# EAGLE design cap (EAGLE 7.2.0)
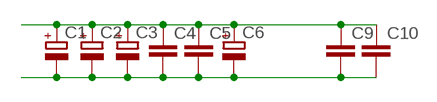
[diagram p0: schematic, sheet 1]

## Parts
C1  CPOL-EUE7.5-18  [E7,5-18]
C2  CPOL-EUE7.5-18  [E7,5-18]
C3  CPOL-EUE7.5-18  [E7,5-18]
C4  C-EU075-052X106  [C075-052X106]
C5  C-EU075-052X106  [C075-052X106]
C6  CPOL-EUE7.5-18  [E7,5-18]
C9  C-EU075-052X106  [C075-052X106]
C10  C-EU075-052X106  [C075-052X106]

## Nets
V+: C1.+ C2.+ C3.+ C4.1 C5.1 C6.+ C9.1 C10.1
V-: C1.- C2.- C3.- C4.2 C5.2 C6.- C9.2 C10.2

## Library data of the parts
C1-C3 C6 = Vwvwbg:CPOL-EU: POLARIZED CAPACITOR, European symbol
C4 C5 C9 C10 = Vwvwbg:C-EU: CAPACITOR, European symbol

## Board
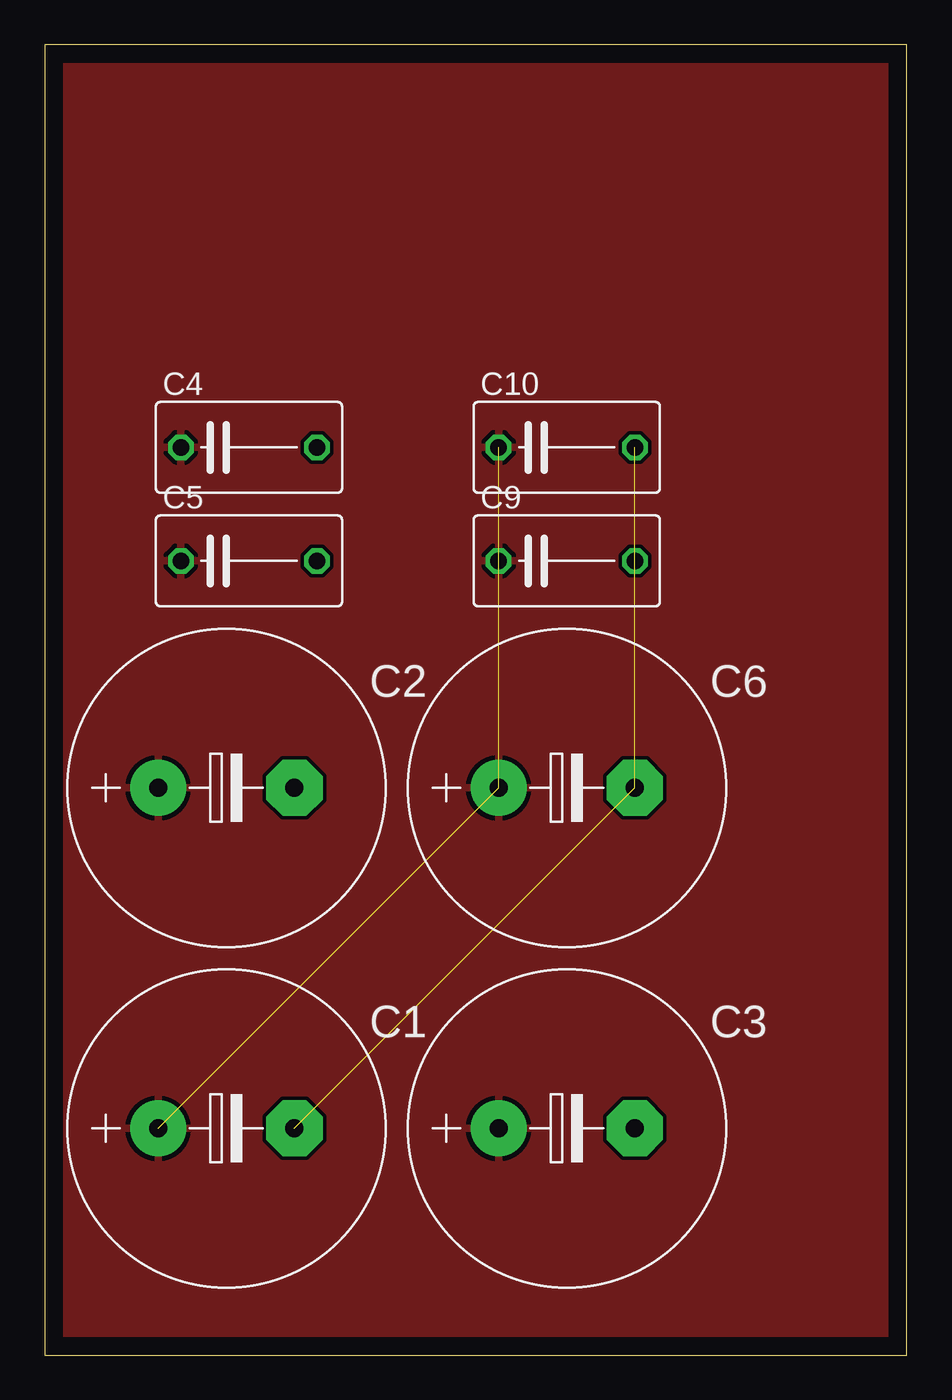
[diagram p1: board, top side]
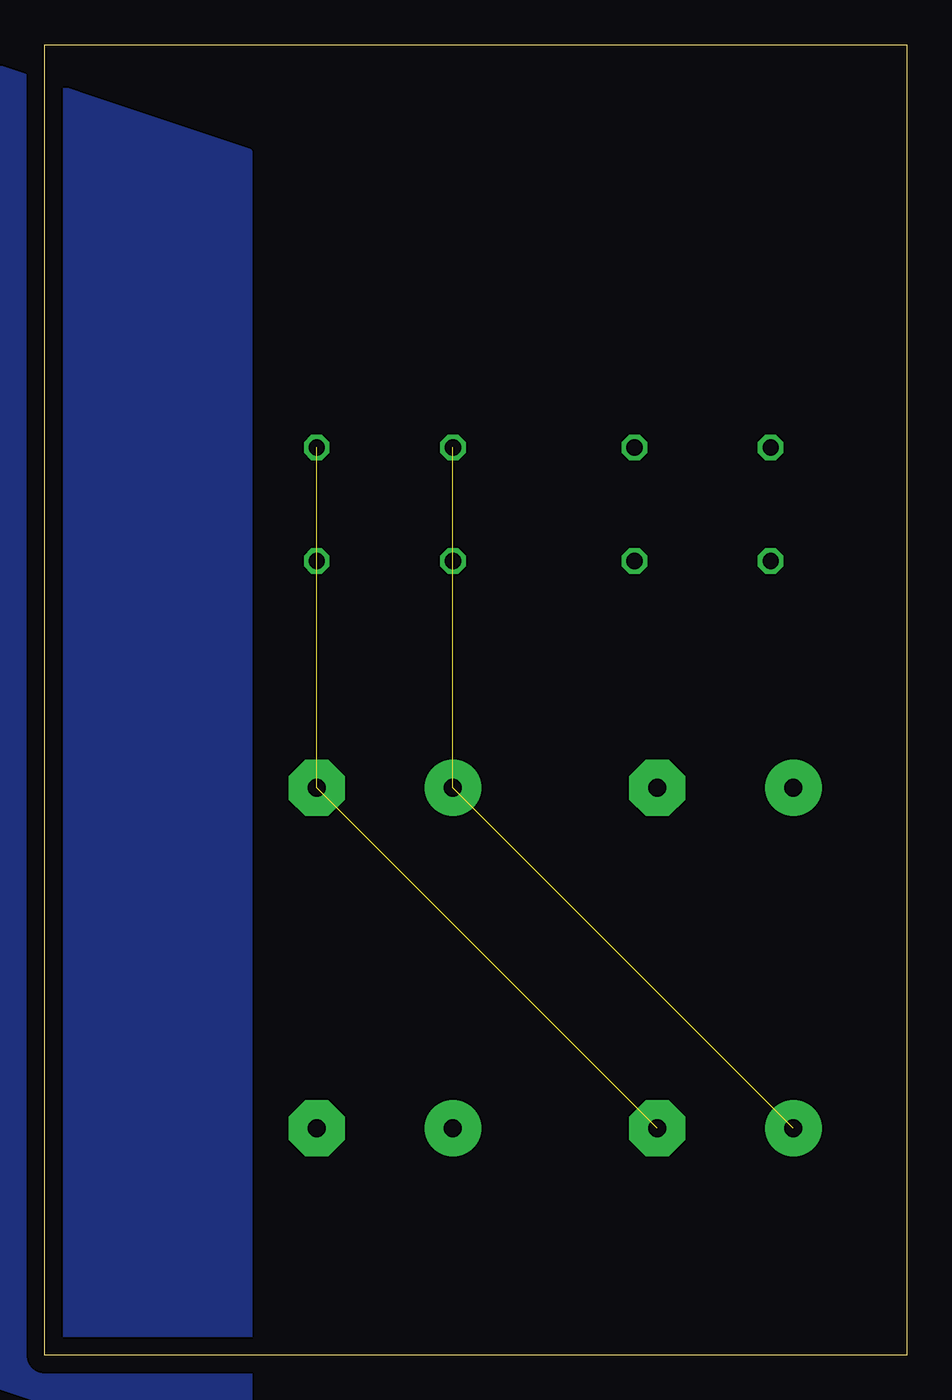
[diagram p2: board, bottom side, seen from below]

Size 48.24 x 73.33 mm. Coordinates in mm from the lower left corner, seen from the top.
Outline: 0,0 48.24,0 48.24,73.33 0,73.33 0,0
Copper layers (1*16): Top 0.035mm / dielectric 1.5mm / Bottom 0.035mm
Design rules "default": minimum track width 10mil, minimum drill 24mil, track to track 8mil, track to pad 8mil, pad to pad 8mil, via to via 8mil, smd to smd 8mil, copper to edge 40mil, drill to drill 8mil, minimum pad ring 10mil, minimum via ring 8mil, stop-mask expansion 4mil, vias tented up to drill 0mil, thermal gap 10mil

### Footprints (pad centres in the part's own frame; a part is rotated, then mirrored left to right if it is on the bottom)
E7,5-18 = drill 1.016 pad 3.15: + -3.81,0 | drill 1.016 pad 3.15 octagon: - 3.81,0
C075-052X106 = drill 0.914 octagon: 1 -3.81,0; 2 3.81,0

### Placement (x,y rotation side)
C1  10.16,12.7 0 top
C2  10.16,31.75 0 top
C3  29.21,12.7 0 top
C4  11.43,50.8 0 top
C5  11.43,44.45 0 top
C6  29.21,31.75 0 top
C9  29.21,44.45 0 top
C10  29.21,50.8 0 top

### Tracks (layer width: path | path; a pad name or v marks a point on that pad's centre or on a via)
V+  (3 unrouted)
  pour Top: 64.77,76.2 -6.35,74.93 -3.81,-3.81 63.5,-2.54
V-  (3 unrouted)
  pour Bottom: 36.83,67.31 36.83,-6.35 55.88,0 55.88,73.66